# Altium schematic sheet mcu_control_unit.SchDoc
size A4; SheetNumber: 2; SheetTotal: 6
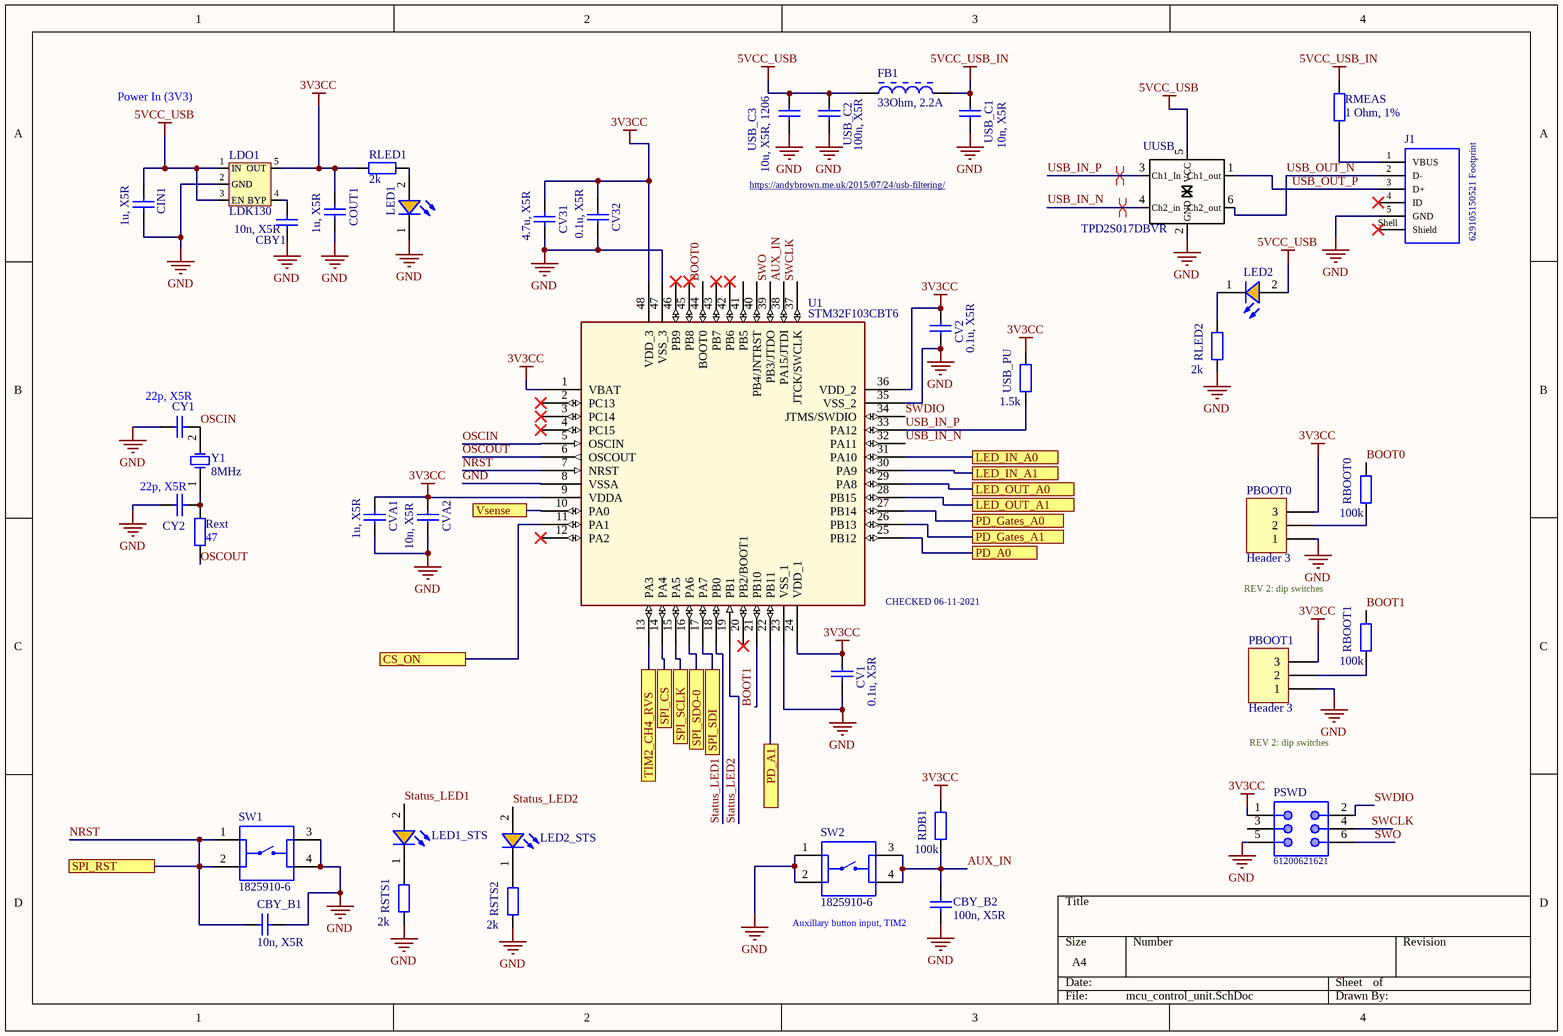
[diagram p0: mcu_control_unit.SchDoc]

## Parts
CBY1  value 10n, X5R  [1608[0603]]
CBY_B1  value 10n, X5R  [1608[0603]]
CBY_B2  value 100n, X5R  [1608[0603]]
CIN1  value 1u, X5R  [1608[0603]]
COUT1  value 1u, X5R  [1608[0603]]
CV1  value 0.1u, X5R  [0402]
CV2  value 0.1u, X5R  [0402]
CV31  value 4.7u, X5R  [1608[0603]]
CV32  value 0.1u, X5R  [0402]
CVA1  value 1u, X5R  [0402]
CVA2  value 10n, X5R  [0402]
CY1  value 22p, X5R  [1608[0603]]
CY2  value 22p, X5R  [1608[0603]]
FB1  33Ohm, 2.2A  [WE-CBF_0603_High Speed]
J1  629105150521 Footprint  [629105150921]
LDO1  LDK130  [LDK130]
LED1  (no value)  [WL-SMCW_0603_H=0.7mm]
LED1_STS  (no value)  [WL-SMCW_0603_H=0.7mm]
LED2  (no value)  [WL-SMCW_0603_H=0.7mm]
LED2_STS  (no value)  [WL-SMCW_0603_H=0.7mm]
PBOOT0  Header 3  [HDR1X3]
PBOOT1  Header 3  [HDR1X3]
PSWD  61200621621  [61200621621]
RBOOT0  100k  [WRIS-KSKE_0805]
RBOOT1  100k  [WRIS-KSKE_0805]
RDB1  100k  [WRIS-KSKE_0805]
Rext  47  [WRIS-KSKE_0805]
RLED1  2k  [WRIS-KSKE_0805]
RLED2  2k  [WRIS-KSKE_0805]
RMEAS  1 Ohm, 1%  [WRIS-KSKE_0603]
RSTS1  2k  [WRIS-KSKE_0805]
RSTS2  2k  [WRIS-KSKE_0805]
SW1  1825910-6  [SW_1825910-6-4]
SW2  1825910-6  [SW_1825910-6-4]
U1  STM32F103CBT6  [LQFP48_0R5_7x7]
USB_C1  value 10n, X5R  [1608[0603]]
USB_C2  value 100n, X5R  [1608[0603]]
USB_C3  value 10u, X5R, 1206  [C1206]
USB_PU  1.5k  [WRIS-KSKE_0805]
UUSB  TPD2S017DBVR  [TPD2S017DBVR]
Y1  8MHz  [WE-XTAL_HC49/4HSMX]

## Ports
CS_ON, LED_IN_A0, LED_IN_A1, LED_OUT_A0, LED_OUT_A1, PD_A0, PD_A1, PD_Gates_A0, PD_Gates_A1, SPI_CS, SPI_RST, SPI_SCLK, SPI_SDI, SPI_SDO-0, TIM2_CH4_RVS, Vsense

## Nets
3V3CC: COUT1.2 CV1.2 CV2.2 CV31.2 CV32.2 CVA1.2 CVA2.2 LDO1.5(OUT) PBOOT0.3 PBOOT1.3 PSWD.1 RDB1.2 RLED1.1 U1.1(VBAT) U1.9(VDDA) U1.24(VDD_1) U1.36(VDD_2) U1.48(VDD_3) USB_PU.2
5VCC_USB: CIN1.2 FB1.1 LDO1.1(IN) LDO1.3(EN) LED2.2(A) USB_C2.2 USB_C3.2 UUSB.5(VCC)
5VCC_USB_IN: FB1.2 RMEAS.2 USB_C1.2
GND: CBY1.1 CBY_B1.1 CBY_B2.2 CIN1.1 COUT1.1 CV1.1 CV2.1 CV31.1 CV32.1 CVA1.1 CVA2.1 CY1.2 CY2.2 J1.5(GND) LDO1.2(GND) LED1.1(K) PBOOT0.1 PBOOT1.1 PSWD.5 RLED2.1 RSTS1.1 RSTS2.1 SW1.3 SW1.4 SW2.1 SW2.2 U1.8(VSSA) U1.23(VSS_1) U1.35(VSS_2) U1.47(VSS_3) USB_C1.1 USB_C2.1 USB_C3.1 UUSB.2(GND)
AUX_IN: CBY_B2.1 RDB1.1 SW2.3 SW2.4 U1.38(PA15/JTDI)
BOOT0: RBOOT0.2 U1.44(BOOT0)
BOOT1: RBOOT1.2 U1.21(PB10)
CS_ON: U1.11(PA1) ; port CS_ON
LED_IN_A0: U1.31(PA10) ; port LED_IN_A0
LED_IN_A1: U1.30(PA9) ; port LED_IN_A1
LED_OUT_A0: U1.29(PA8) ; port LED_OUT_A0
LED_OUT_A1: U1.28(PB15) ; port LED_OUT_A1
NRST: CBY_B1.2 SW1.1 SW1.2 U1.7(NRST) ; port SPI_RST
OSCIN: CY1.1 U1.5(OSCIN) Y1.2(OSC2)
OSCOUT: Rext.1 U1.6(OSCOUT)
PD_A0: U1.25(PB12) ; port PD_A0
PD_A1: U1.22(PB11) ; port PD_A1
PD_Gates_A0: U1.27(PB14) ; port PD_Gates_A0
PD_Gates_A1: U1.26(PB13) ; port PD_Gates_A1
SPI_CS: U1.14(PA4) ; port SPI_CS
SPI_SCLK: U1.15(PA5) ; port SPI_SCLK
SPI_SDI: U1.17(PA7) ; port SPI_SDI
SPI_SDO-0: U1.16(PA6) ; port SPI_SDO-0
Status_LED1: LED1_STS.2(A) U1.18(PB0)
Status_LED2: LED2_STS.2(A) U1.19(PB1)
SWCLK: PSWD.4 U1.37(JTCK/SWCLK)
SWDIO: PSWD.2 U1.34(JTMS/SWDIO)
SWO: PSWD.6 U1.39(PB3/JTDO)
TIM2_CH4_RVS: U1.13(PA3) ; port TIM2_CH4_RVS
USB_IN_N: U1.32(PA11) UUSB.4(Ch2_in)
USB_IN_P: U1.33(PA12) USB_PU.1 UUSB.3(Ch1_In)
USB_OUT_N: J1.2(D-) UUSB.6(Ch2_out)
USB_OUT_P: J1.3(D+) UUSB.1(Ch1_out)
Vsense: U1.10(PA0) ; port Vsense
NetCBY1_2: CBY1.2 LDO1.4(BYP)
NetCY2_1: CY2.1 Rext.2 Y1.1(OSC1)
NetJ1_1: J1.1(VBUS) RMEAS.1
NetLED1_2: LED1.2(A) RLED1.2
NetLED1_STS_1: LED1_STS.1(K) RSTS1.2
NetLED2_1: LED2.1(K) RLED2.2
NetLED2_STS_1: LED2_STS.1(K) RSTS2.2
NetPBOOT0_2: PBOOT0.2 RBOOT0.1
NetPBOOT1_2: PBOOT1.2 RBOOT1.1

Not connected (* = marked no-connect by the designer): J1 4(ID)* Shell(Shield)*; PSWD 3; U1 2(PC13)* 3(PC14)* 4(PC15)* 12(PA2)* 20(PB2/BOOT1)* 40(PB4/JNTRST) 41(PB5) 42(PB6)* 43(PB7)* 45(PB8)* 46(PB9)*

## Layout directives
differential pair: USB_IN_N, USB_IN_P

## Notes on the sheet
- Power In (3V3)
- https://andybrown.me.uk/2015/07/24/usb-filtering/
- (near U1) CHECKED 06-11-2021
- REV 2: dip switches
- (near CBY_B2) Auxillary button input, TIM2

## Library data of the parts
CBY1 CBY_B1 CBY_B2 CIN1 COUT1 CV1 CV2 CV31 CV32 CVA1 CVA2 CY1 CY2 USB_C1-USB_C3 = Cap Semi: Capacitor (Semiconductor SIM Model); Published: 8-Jun-2000; LatestRevisionDate: 29-May-2009; LatestRevisionNote: IPC-7351 Footprint Added.; PackageReference: C1206; Publisher: Altium Limited; PackageDescription: Chip Capacitor
FB1 = 742792605: WE-CBF SMT EMI Suppression Ferrite Bead, size 0603, 33Ohm, 2.2A; Manufacturer: Wurth Elektronik; Impedance max.: 50Ohm; DC Resistance max.: 0.1Ohm; Type: High Speed; ComponentLink1Description: Manufacturer; ComponentLink1URL: http://www.we-online.de; ComponentLink2Description: Datasheet; ComponentLink2URL: https://www.we-online.com/catalog/datasheet/742792605.pdf; Operating Temperature: -55 to +125degC; Packaging: Tape and Reel; Published Date: March 2020; Rated Current: 2.2A; Manufacturer Part Number: 742792605; Impedance @100MHz: 33Ohm; Mounting Technology: SMT; Size: 0603
J1 = 629105150921: Micro USB 2.0 Type AB, Receptacle, Horizontal, SMT; Manufacturer: Wurth Elektronik; Rated Current: 1.8A; Pin Number: 5; Interface Type: Type AB; Working Voltage: 30VAC; ComponentLink1Description: Manufacturer; ComponentLink1URL: http://www.we-online.de; ComponentLink2Description: Datasheet; ComponentLink2URL: https://katalog.we-online.com/em/datasheet/629105150921.pdf; Published Date: August 2020; Manufacturer Part Number: 629105150921; Gender: Receptacle; Type: Horizontal; Packaging: Tape and Reel; Operating Temperature: -40 to +85degC; Mounting Technology: SMT; Application: Micro USB 2.0
LDO1 = LDK130: 300 mA low quiescent current very low noise LDO
LED1 LED1_STS LED2 LED2_STS = 150060AS75000: WL-SMCW SMT Mono-color Chip LED Waterclear, size 0603, Amber, 2V, 140deg; Chip Technology: AlInGaP; Dominant Wavelength typ.: 605nm; Luminous Intensity typ.: 130mcd; Peak Wavelength typ.: 610nm; Viewing Angle: 140deg; ComponentLink1Description: Manufacturer; ComponentLink1URL: http://www.we-online.de; ComponentLink2URL: https://www.we-online.com/catalog/datasheet/150060AS75000.pdf; ComponentLink2Description: Datasheet; Forward Voltage typ.: 2V; Emitting Color: Amber; Mounting Technology: SMT; Operating Temperature: -40 to +85degC; Published Date: December 2019; Part Number: 150060AS75000; Packaging: Tape and Reel; Size: 0603; Publisher: Wurth Elektronik
PBOOT0 PBOOT1 = Header 3: Header, 3-Pin; LatestRevisionDate: 17-Jul-2002; LatestRevisionNote: Re-released for DXP Platform.; Publisher: Altium Limited
PSWD = 61200621621: Male Box Header WR-BHD, THT, Vertical, pitch 2.54 mm, 6 pins; Pitch: 2.54 mm; Working Voltage: 250 VAC; Withstanding Voltage: 500 VAC; Contact Resistance: 20 mOhm; Pin Number: 6; ComponentLink1Description: Manufacturer; ComponentLink1URL: http://www.we-online.de; ComponentLink2Description: Datasheet; ComponentLink2URL: https://katalog.we-online.de/em/datasheet/6120xx21621.pdf; Part Number: 61200621621; Published Date: August 2018; Publisher: Wurth Elektronik; Operating Temperature: -40 to 125 degC; Packaging: Tray; Gender: Male; Mounting Technology: THT; Orientation: Vertical
RBOOT0 RBOOT1 RDB1 Rext RLED1 RLED2 RSTS1 RSTS2 USB_PU = 560050320001: WRIS-KSKE SMT Thick Film Resistor, size 0805, 0.1Ohm, 0.33W; Manufacturer: Wurth Elektronik; Rated Current: 1.81A; Temperature Coefficient of Resistance: 250ppm/degC; Technical Reference: KE0805R100F103LAATP0000; Resistance Tolerance: +/-1%; ComponentLink1Description: Manufacturer; ComponentLink1URL: http://www.we-online.de; ComponentLink2Description: Datasheet; ComponentLink2URL: https://www.we-online.com/catalog/datasheet/560050320001.pdf; Published Date: May 2020; Rated Power: 0.33W; Resistance: 0.1Ohm; Height: 0.6mm; Operating Temperature: -55 to +155degC; Mounting Technology: SMT; Packaging: Tape and Reel; Size: 0805; Length: 2mm; Manufacturer Part Number: 560050320001; Width: 1.25mm
RMEAS = 560050316011: WRIS-KSKE SMT Thick Film Resistor, size 0603, 0.5Ohm, 0.25W; Manufacturer: Wurth Elektronik; Rated Current: 0.7A; Temperature Coefficient of Resistance: +/-100ppm/degC; Technical Reference: KE0603R500F104KAATP0000; Resistance Tolerance: +/-1%; ComponentLink1Description: Manufacturer; ComponentLink1URL: http://www.we-online.de; ComponentLink2Description: Datasheet; ComponentLink2URL: https://www.we-online.com/catalog/datasheet/560050316011.pdf; Published Date: May 2020; Rated Power: 0.25W; Resistance: 0.5Ohm; Height: 0.45mm; Operating Temperature: -55 to +155degC; Mounting Technology: SMT; Packaging: Tape and Reel; Size: 0603; Length: 1.6mm; Manufacturer Part Number: 560050316011; Width: 0.8mm
SW1 SW2 = 1825910-6: Switch Push Button OFF _ON_ SPST Round Button 0.05A 24VDC Momentary Contact PC Pins Thru-Hole; Configuration_Pole-Throw: Single Pole - Single Throw; MF: TE Connectivity; Contact_Current_Rating: 50 mA; Digi-Key_Purchase_URL: https://www.digikey.com/product-detail/en/te-connectivity-alcoswitch-switches/1825910-6/450-1650-ND/1632536?utm_source=snapeda&utm_medium=aggregator&utm_campaign=symbol; TE_purchase_URL: https://www.te.com/usa-en/product-1825910-6.html?te_bu=Cor&te_type=disp&te_campaign=seda_glo_cor-seda-global-disp-prtnr-fy19-seda-model-bom-cta_sma-317_1&elqCampaignId=32493; Value: *; Digi-Key_Part_Number: 450-1650-ND; SnapEDA_Link: https://www.snapeda.com/parts/1825910-6/TE%20Connectivity%20ALCOSWITCH%20Switches/view-part/424522/?ref=snap; EU_RoHS_Compliance: Compliant; MP: 1825910-6; Package: None
U1 = STM32F103CBT6: Medium-density performance line ARM-based 32-bit MCU with 64KB Flash; Manuf_Part_1: STM32F103C8T6; Manuf_1: STM; Ref St: 9175981; Provided: ST; ECCN_US/EU: 3A991A2/NEC; Footprint: QFP48 7X7; Distrib: ST; Order: STM32F103C8T6
UUSB = TPD2S017DBVR: 2-Channel Ultra-Low Clamp Voltage ESD / Solution With Series-Resistor Isolation
Y1 = 830003151: WE-XTAL Quartz Crystal, SMT, HC49/4HSMX, 8MHz, +/-30ppm; Manufacturer: Wurth Elektronik; Frequency Stability: +/-50ppm; Load Capacitance: 16pF; ComponentLink1Description: Manufacturer; ComponentLink1URL: http://www.we-online.de; ComponentLink2Description: Datasheet; ComponentLink2URL: https://katalog.we-online.com/pbs/datasheet/830003151.pdf; Operating Temperature: -10 to +60degC; Packaging: Tape and Reel; Manufacturer Part Number: 830003151; Published Date: July 2020; Size: HC49/4HSMX; Frequency: 8MHz; Frequency Tolerance: +/-30ppm; Mounting Technology: SMT